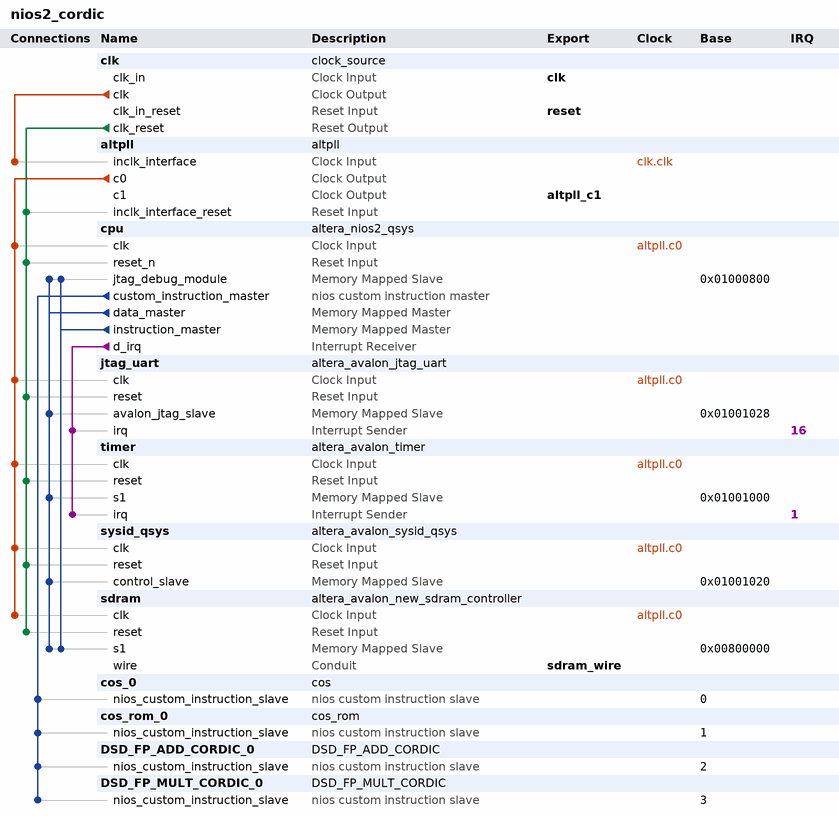
[diagram p0: system contents]
# Platform Designer (Qsys) system nios2_cordic, Cyclone III EP3C16F484C6
# Parameters at their usual value, and those the tool derives, are not listed.
package require -exact qsys 13.0
create_system nios2_cordic
set_project_property DEVICE_FAMILY {Cyclone III}
set_project_property DEVICE EP3C16F484C6

add_instance clk clock_source 13.0
set_instance_parameter_value clk clockFrequency 50000000

add_instance altpll altpll 13.0
set_instance_parameter_value altpll INCLK0_INPUT_FREQUENCY 20000
set_instance_parameter_value altpll CLK0_MULTIPLY_BY 1
set_instance_parameter_value altpll CLK1_MULTIPLY_BY 1
set_instance_parameter_value altpll CLK0_DIVIDE_BY 1
set_instance_parameter_value altpll CLK1_DIVIDE_BY 1
set_instance_parameter_value altpll CLK1_PHASE_SHIFT -2604
set_instance_parameter_value altpll CLK1_DUTY_CYCLE 50
set_instance_parameter_value altpll PORT_clk1 PORT_USED
set_instance_parameter_value altpll PORT_clk2 PORT_UNUSED
set_instance_parameter_value altpll PORT_clk3 PORT_UNUSED
set_instance_parameter_value altpll PORT_ARESET PORT_UNUSED
set_instance_parameter_value altpll PORT_LOCKED PORT_UNUSED

add_instance cpu altera_nios2_qsys 13.0
set_instance_parameter_value cpu resetSlave sdram.s1
set_instance_parameter_value cpu mmu_TLBMissExcSlave None
set_instance_parameter_value cpu exceptionSlave sdram.s1
set_instance_parameter_value cpu breakSlave cpu.jtag_debug_module
set_instance_parameter_value cpu impl Small
set_instance_parameter_value cpu icache_size 32768

add_instance jtag_uart altera_avalon_jtag_uart 13.0.1.99.2
set_instance_parameter_value jtag_uart simInteractiveOptions NO_INTERACTIVE_WINDOWS

add_instance timer altera_avalon_timer 13.0.1.99.2
set_instance_parameter_value timer period 1
set_instance_parameter_value timer periodUnits MSEC

add_instance sysid_qsys altera_avalon_sysid_qsys 13.0
set_instance_parameter_value sysid_qsys id 0

add_instance sdram altera_avalon_new_sdram_controller 13.0.1.99.2
set_instance_parameter_value sdram TAC 5.5
set_instance_parameter_value sdram TRCD 20.0
set_instance_parameter_value sdram TRP 20.0
set_instance_parameter_value sdram casLatency 3
set_instance_parameter_value sdram columnWidth 8
set_instance_parameter_value sdram dataWidth 16
set_instance_parameter_value sdram generateSimulationModel false
set_instance_parameter_value sdram model single_Micron_MT48LC4M32B2_7_chip
set_instance_parameter_value sdram numberOfBanks 4
set_instance_parameter_value sdram numberOfChipSelects 1
set_instance_parameter_value sdram powerUpDelay 100.0
set_instance_parameter_value sdram refreshPeriod 15.625
set_instance_parameter_value sdram rowWidth 12

add_instance cos_0 cos 1.0

add_instance cos_rom_0 cos_rom 1.0

add_instance DSD_FP_ADD_CORDIC_0 DSD_FP_ADD_CORDIC 1.0

add_instance DSD_FP_MULT_CORDIC_0 DSD_FP_MULT_CORDIC 1.0

# connections
add_connection altpll.c0 cpu.clk clock
add_connection altpll.c0 jtag_uart.clk clock
add_connection altpll.c0 sdram.clk clock
add_connection altpll.c0 sysid_qsys.clk clock
add_connection altpll.c0 timer.clk clock
add_connection clk.clk altpll.inclk_interface clock
add_connection clk.clk_reset altpll.inclk_interface_reset reset
add_connection clk.clk_reset cpu.reset_n reset
add_connection clk.clk_reset jtag_uart.reset reset
add_connection clk.clk_reset sdram.reset reset
add_connection clk.clk_reset sysid_qsys.reset reset
add_connection clk.clk_reset timer.reset reset
add_connection cpu.data_master cpu.jtag_debug_module avalon
set_connection_parameter_value cpu.data_master/cpu.jtag_debug_module baseAddress 0x01000800
add_connection cpu.data_master jtag_uart.avalon_jtag_slave avalon
set_connection_parameter_value cpu.data_master/jtag_uart.avalon_jtag_slave baseAddress 0x01001028
add_connection cpu.data_master sdram.s1 avalon
set_connection_parameter_value cpu.data_master/sdram.s1 baseAddress 0x00800000
add_connection cpu.data_master sysid_qsys.control_slave avalon
set_connection_parameter_value cpu.data_master/sysid_qsys.control_slave baseAddress 0x01001020
add_connection cpu.data_master timer.s1 avalon
set_connection_parameter_value cpu.data_master/timer.s1 baseAddress 0x01001000
add_connection cpu.instruction_master cpu.jtag_debug_module avalon
set_connection_parameter_value cpu.instruction_master/cpu.jtag_debug_module baseAddress 0x01000800
add_connection cpu.instruction_master sdram.s1 avalon
set_connection_parameter_value cpu.instruction_master/sdram.s1 baseAddress 0x00800000
add_connection cpu.d_irq jtag_uart.irq interrupt
set_connection_parameter_value cpu.d_irq/jtag_uart.irq irqNumber 16
add_connection cpu.d_irq timer.irq interrupt
set_connection_parameter_value cpu.d_irq/timer.irq irqNumber 1
add_connection cpu.custom_instruction_master cos_0.nios_custom_instruction_slave nios_custom_instruction
set_connection_parameter_value cpu.custom_instruction_master/cos_0.nios_custom_instruction_slave CIName cos_0
set_connection_parameter_value cpu.custom_instruction_master/cos_0.nios_custom_instruction_slave baseAddress 0
add_connection cpu.custom_instruction_master cos_rom_0.nios_custom_instruction_slave nios_custom_instruction
set_connection_parameter_value cpu.custom_instruction_master/cos_rom_0.nios_custom_instruction_slave CIName cos_rom_0
set_connection_parameter_value cpu.custom_instruction_master/cos_rom_0.nios_custom_instruction_slave baseAddress 1
add_connection cpu.custom_instruction_master DSD_FP_ADD_CORDIC_0.nios_custom_instruction_slave nios_custom_instruction
set_connection_parameter_value cpu.custom_instruction_master/DSD_FP_ADD_CORDIC_0.nios_custom_instruction_slave CIName dsd_fp_add_cordic_0
set_connection_parameter_value cpu.custom_instruction_master/DSD_FP_ADD_CORDIC_0.nios_custom_instruction_slave baseAddress 2
add_connection cpu.custom_instruction_master DSD_FP_MULT_CORDIC_0.nios_custom_instruction_slave nios_custom_instruction
set_connection_parameter_value cpu.custom_instruction_master/DSD_FP_MULT_CORDIC_0.nios_custom_instruction_slave CIName dsd_fp_mult_cordic_0
set_connection_parameter_value cpu.custom_instruction_master/DSD_FP_MULT_CORDIC_0.nios_custom_instruction_slave baseAddress 3

# exported interfaces
add_interface clk clock sink
set_interface_property clk EXPORT_OF clk.clk_in
add_interface reset reset sink
set_interface_property reset EXPORT_OF clk.clk_in_reset
add_interface sdram_wire conduit end
set_interface_property sdram_wire EXPORT_OF sdram.wire
add_interface altpll_c1 clock source
set_interface_property altpll_c1 EXPORT_OF altpll.c1

set_interconnect_requirement {$system} qsys_mm.clockCrossingAdapter HANDSHAKE
set_interconnect_requirement {$system} qsys_mm.maxAdditionalLatency 1

save_system nios2_cordic.qsys
